# EAGLE design mv-uart (EAGLE 7.6.0)
VERSION: v2
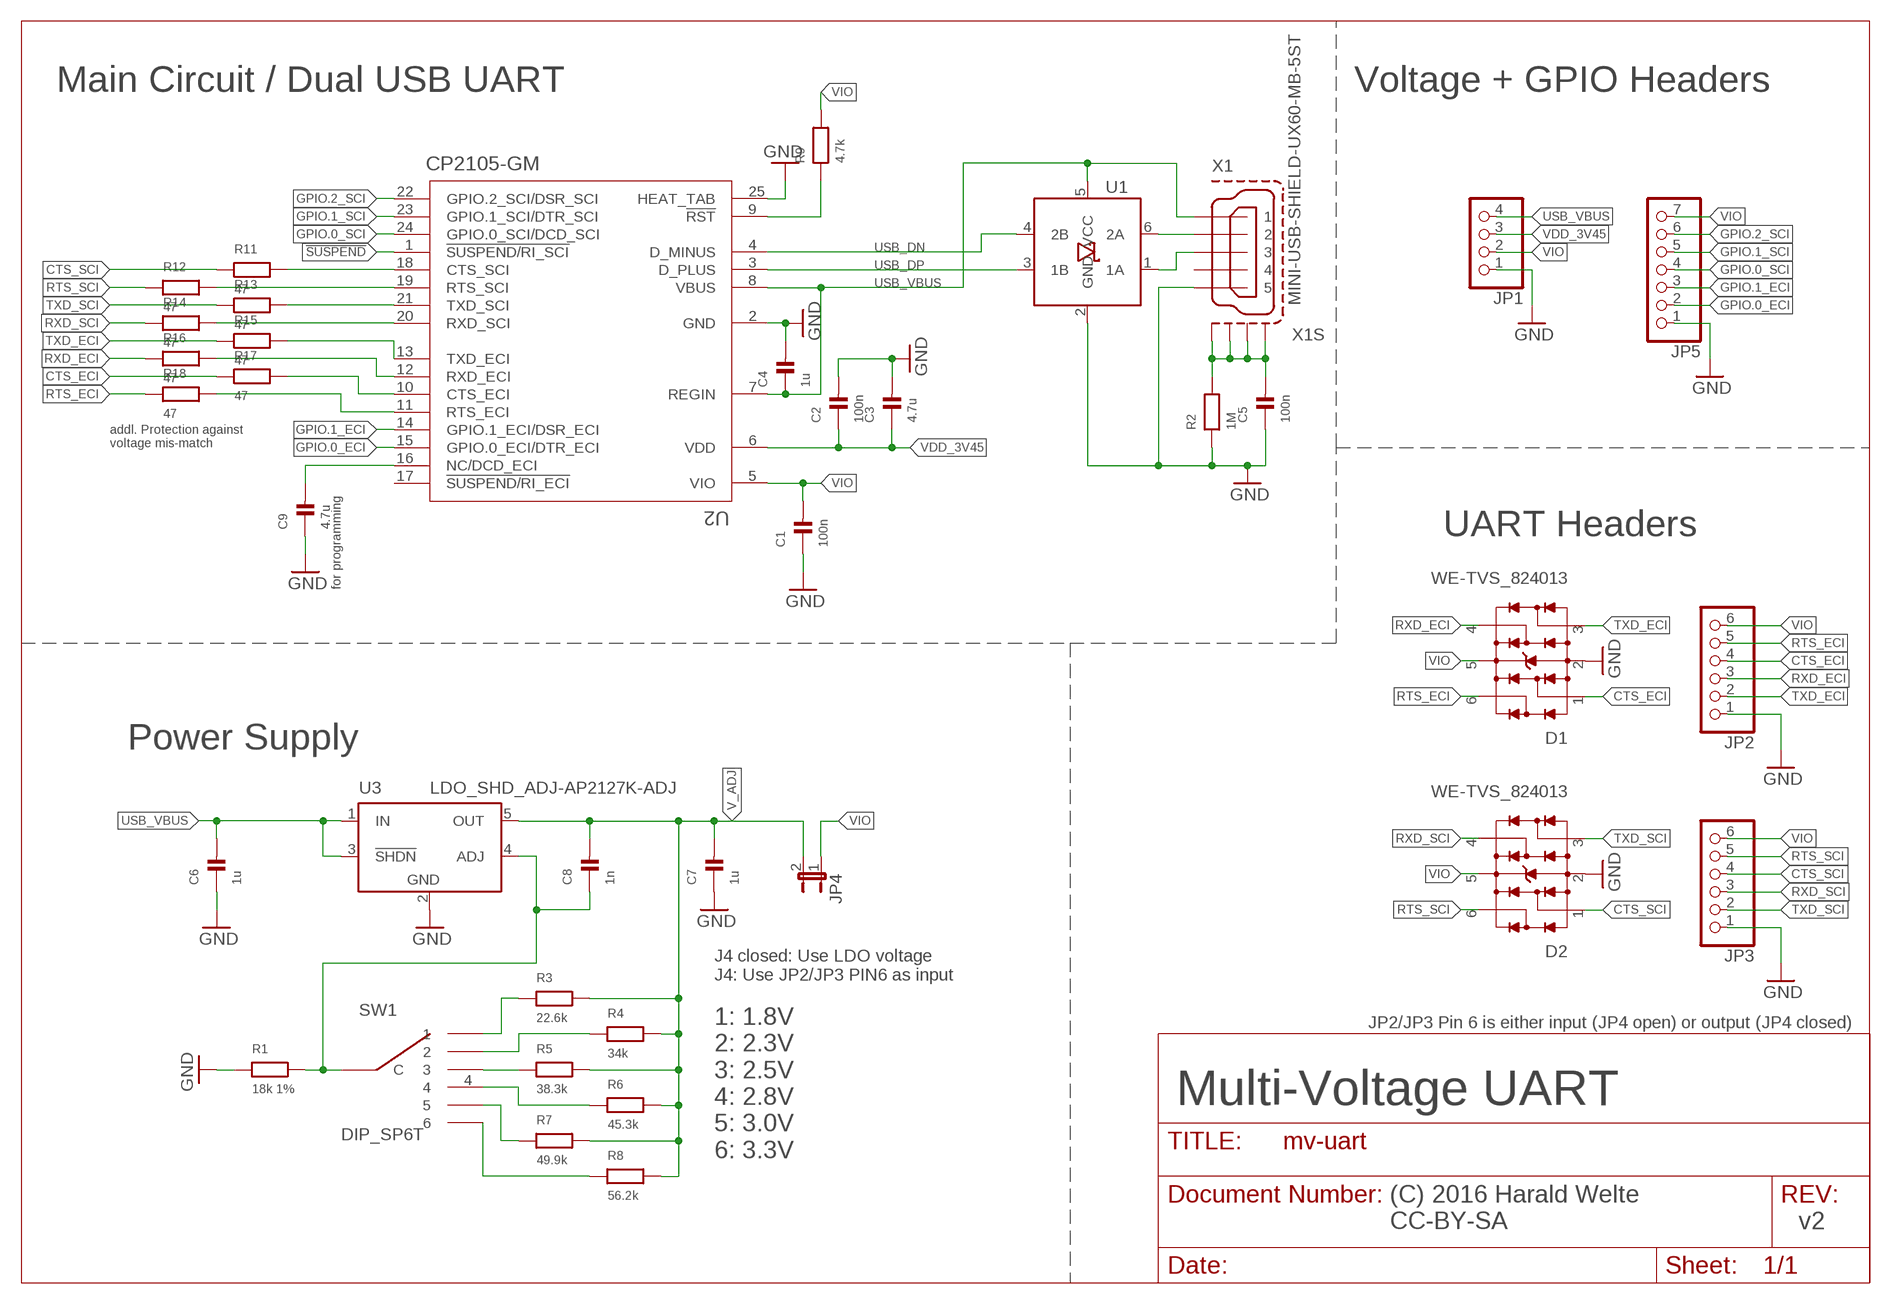
[diagram p0: schematic, sheet 1]

## Parts
C1  100n  CAP_CERAMIC_0603  [_0603]
C2  100n  CAP_CERAMIC_0603  [_0603]
C3  4.7u  CAP_CERAMIC_0603  [_0603]
C4  1u  CAP_CERAMIC_0603  [_0603]
C5  100n  CAP_CERAMIC_0603  [_0603]
C6  1u  CAP_CERAMIC_0603  [_0603]
C7  1u  CAP_CERAMIC_0603  [_0603]
C8  1n  CAP_CERAMIC_0603  [_0603]
C9  4.7u  CAP_CERAMIC_0603  [_0603]
D1  WE-TVS_824013  [WE-TVS_SOT23-6L]
D2  WE-TVS_824013  [WE-TVS_SOT23-6L]
JP1  PINHD-1X4  [1X04]
JP2  PINHD-1X6/90  [1X06/90]
JP3  PINHD-1X6/90  [1X06/90]
JP4  JP1E  [JP1]
JP5  PINHD-1X7  [1X07]
R1  18k 1%  RESISTOR_0603  [_0603]
R2  1M  RESISTOR_0603  [_0603]
R3  22.6k  RESISTOR_0603  [_0603]
R4  34k  RESISTOR_0603  [_0603]
R5  38.3k  RESISTOR_0603  [_0603]
R6  45.3k  RESISTOR_0603  [_0603]
R7  49.9k  RESISTOR_0603  [_0603]
R8  56.2k  RESISTOR_0603  [_0603]
R9  4.7k  RESISTOR_0603  [_0603]
R11  47  RESISTOR_0603  [_0603]
R12  47  RESISTOR_0603  [_0603]
R13  47  RESISTOR_0603  [_0603]
R14  47  RESISTOR_0603  [_0603]
R15  47  RESISTOR_0603  [_0603]
R16  47  RESISTOR_0603  [_0603]
R17  47  RESISTOR_0603  [_0603]
R18  47  RESISTOR_0603  [_0603]
SW1  DIP_SP6T  [DIP_SP6T]
U1  IP4234CZ6  [TSOP-6]
U2  CP2105-GM  [QFN24_4X4]
U3  LDO_SHD_ADJ-AP2127K-ADJ  [SOT23L]
X1  MINI-USB-SHIELD-UX60-MB-5ST  [UX60-MB-5ST]

## Nets
!SUSPEND: U2.1(!SUSPEND/RI_SCI)
_USB_DN: U1.6(2A) X1.2
_USB_DP: U1.1(1A) X1.3
CTS_ECI: D1.1 JP2.4 R17.1
CTS_SCI: D2.1 JP3.4 R11.1
GND: C1.1 C2.2 C3.2 C4.2 C5.1 C6.1 C7.1 C9.1 D1.2(GND) D2.2(GND) JP1.1 JP2.1 JP3.1 JP5.1 R1.1 R2.1 U1.2(GND) U2.2(GND) U2.25(HEAT_TAB) U3.2(GND) X1.5
GPIO.0_ECI: JP5.2 U2.15(GPIO.0_ECI/DTR_ECI)
GPIO.0_SCI: JP5.4 U2.24(GPIO.0_SCI/DCD_SCI)
GPIO.1_ECI: JP5.3 U2.14(GPIO.1_ECI/DSR_ECI)
GPIO.1_SCI: JP5.5 U2.23(GPIO.1_SCI/DTR_SCI)
GPIO.2_SCI: JP5.6 U2.22(GPIO.2_SCI/DSR_SCI)
N$1: R3.1 SW1.1
N$2: R4.1 SW1.2
N$3: R5.1 SW1.3
N$4: R6.1 SW1.4
N$5: C5.2 R2.2 X1.M1(S1) X1.M2(S2) X1.M3(S3) X1.M4(S4)
N$6: R7.1 SW1.5
N$7: R8.1 SW1.6
N$8: R9.1 U2.9(!RST)
N$9: C9.2 U2.16(NC/DCD_ECI)
N$10: R11.2 U2.18(CTS_SCI)
N$11: R12.2 U2.19(RTS_SCI)
N$12: R13.2 U2.21(TXD_SCI)
N$13: R14.2 U2.20(RXD_SCI)
N$14: R15.2 U2.13(TXD_ECI)
N$15: C8.1 R1.2 SW1.C U3.4(ADJ)
N$16: R16.2 U2.12(RXD_ECI)
N$17: R17.2 U2.10(CTS_ECI)
N$18: R18.2 U2.11(RTS_ECI)
RTS_ECI: D1.6 JP2.5 R18.1
RTS_SCI: D2.6 JP3.5 R12.1
RXD_ECI: D1.4 JP2.3 R16.1
RXD_SCI: D2.4 JP3.3 R14.1
TXD_ECI: D1.3 JP2.2 R15.1
TXD_SCI: D2.3 JP3.2 R13.1
USB_DN: U1.4(2B) U2.4(D_MINUS)
USB_DP: U1.3(1B) U2.3(D_PLUS)
USB_VBUS: C4.1 C6.2 JP1.4 U1.5(VCC) U2.7(REGIN) U2.8(VBUS) U3.1(IN) U3.3(!SHDN) X1.1
V_ADJ: C7.2 C8.2 JP4.2 R3.2 R4.2 R5.2 R6.2 R7.2 R8.2 U3.5(OUT)
VDD_3V45: C2.1 C3.1 JP1.3 U2.6(VDD)
VIO: C1.2 D1.5(VDD) D2.5(VDD) JP1.2 JP2.6 JP3.6 JP4.1 JP5.7 R9.2 U2.5(VIO)
Unconnected: U2.17(!SUSPEND/RI_ECI) X1.4

## Notes on the sheet
- Main Circuit / Dual USB UART | Voltage + GPIO Headers
- addl. Protection against
  voltage mis-match
- UART Headers
- for programming
- Power Supply
- J4 closed: Use LDO voltage
  J4: Use JP2/JP3 PIN6 as input
- JP2/JP3 Pin 6 is either input (JP4 open) or output (JP4 closed)
- Multi-Voltage UART
- 1: 1.8V
  2: 2.3V
  3: 2.5V
  4: 2.8V
  5: 3.0V
  6: 3.3V
- (C) 2016 Harald Welte
  CC-BY-SA

## Library data of the parts
C1 C2 C5 = rc-sysmocom:CAP_CERAMIC: Ceramic Capacitors 0402 - 0402 Surface Mount Capacitors 16pF 50V 5% [Digikey: 445-4899-2-ND] 18pF 50V 5% [Digikey: 490-1281-2-ND] 22pF 50V 5% [Digikey: 490-1283-2-ND] 68pF 50V 5% [Digikey: 490-1289-2-ND] 0.1uF 10V 10% [Digikey: 490-1318-2-ND] 1.0uF 6.3V 10% [Digikey: 490-1320-2-ND] 0603 - 0603 Surface Mount Capacitors 16 pF 50V 5% [Digikey: 445-5051-2-ND] 22 pF 50V [Digikey: PCC220ACVTR-ND] 33 pF 50V 5% [Digikey: 490-1415-1-ND] 56pF 50V 5% [Digikey: 490-1421-1-ND] 220pF 50V 5% [Digikey: 445-1285-1-ND] 680 pF 50V 2200 pF 50V 5% C0G [Digikey: 445-1297-1-ND] 5600 pF 100V 5% X7R [Digikey: 478-3711-1-ND] 0.1 µF 25V 10% [Digikey: PCC2277TR-ND] 0.22 µF 16V 10% X7R [Digikey: 445-1318-1-ND] 1.0 µF 25V 10% [Digikey: 445-5146-2-ND] 0603 - RF Specific 3pF 250V +/-0.1pF RF [Digikey: 712-1347-1-ND] 18 pF 250V 5% [Digikey: 478-3505-1-ND or 712-1322-1-ND] 56 pF 250V 5% C0G RF [Digikey: 490-4867-1-ND] 68 pF 250V RF [Digikey: 490-4868-1-ND] 0805 - 0805 Surface Mount Capacitors 220 pF 250V 2% RF Ceramic Capacitor [Digikey: 712-1398-1-ND] 1000 pF 50V 2% NP0 Ceramic Capacitor [Digikey: 478-3760-1-ND] 0.1 µF 25V 10% Ceramic Capacitor [Digikey: PCC1828TR-ND] 1.0 µF 16V 10% Ceramic Capacitor[Digikey: 490-1691-2-ND] 10.0 µF 10V 10% Ceramic Capacitor[Digikey: 709-1228-1-ND] 10.0 uF 16V 10% Ceramic Capacitor [Digikey: 478-5165-2-ND] 47 uF 6.3V 20% Ceramic Capacitor [Digikey: 587-1779-1-ND or 399-5506-1-ND] 1206 - 1206 Surface Mount Capacitors 47uF 10V 20% Ceramic Capacitor [Digikey: 490-5528-1-ND or 399-5508-1-ND or 445-6010-1-ND] 100uF 6.3V -20%, +80% Y5V Ceramic Capacitor (Digikey: 490-4512-1-ND, Mouser: 81-GRM31CF50J107ZE1L) 1810 - 1810 Surface Mount Capacitors High volt MLC; no solder stop between for higher isolation; CLASS: CAPACITOR; DESCRIPTION: 0.10µF 16V Ceramic Capacitor X5R 0201 (0603 Metric) 0.024" L x 0.012" W (0.60mm x 0.30mm); LINK: http://www.digikey.com/product-detail/en/murata-electronics-north-america/GRM033R61C104KE84D/490-9985-1-ND/5026290; MANUFACTURER: Murata Electronics North America; MANUFACTURERPARTNUMBER: GRM033R61C104KE84D; POPULATED: TRUE; ROHSCERTIFICATE: UNKNOWN ROHS CERTIFICATE; SOURCE: DIGIKEY; SOURCEPARTNUMBER: 490-9985-1-ND
C3 C9 = rc-sysmocom:CAP_CERAMIC: Ceramic Capacitors 0402 - 0402 Surface Mount Capacitors 16pF 50V 5% [Digikey: 445-4899-2-ND] 18pF 50V 5% [Digikey: 490-1281-2-ND] 22pF 50V 5% [Digikey: 490-1283-2-ND] 68pF 50V 5% [Digikey: 490-1289-2-ND] 0.1uF 10V 10% [Digikey: 490-1318-2-ND] 1.0uF 6.3V 10% [Digikey: 490-1320-2-ND] 0603 - 0603 Surface Mount Capacitors 16 pF 50V 5% [Digikey: 445-5051-2-ND] 22 pF 50V [Digikey: PCC220ACVTR-ND] 33 pF 50V 5% [Digikey: 490-1415-1-ND] 56pF 50V 5% [Digikey: 490-1421-1-ND] 220pF 50V 5% [Digikey: 445-1285-1-ND] 680 pF 50V 2200 pF 50V 5% C0G [Digikey: 445-1297-1-ND] 5600 pF 100V 5% X7R [Digikey: 478-3711-1-ND] 0.1 µF 25V 10% [Digikey: PCC2277TR-ND] 0.22 µF 16V 10% X7R [Digikey: 445-1318-1-ND] 1.0 µF 25V 10% [Digikey: 445-5146-2-ND] 0603 - RF Specific 3pF 250V +/-0.1pF RF [Digikey: 712-1347-1-ND] 18 pF 250V 5% [Digikey: 478-3505-1-ND or 712-1322-1-ND] 56 pF 250V 5% C0G RF [Digikey: 490-4867-1-ND] 68 pF 250V RF [Digikey: 490-4868-1-ND] 0805 - 0805 Surface Mount Capacitors 220 pF 250V 2% RF Ceramic Capacitor [Digikey: 712-1398-1-ND] 1000 pF 50V 2% NP0 Ceramic Capacitor [Digikey: 478-3760-1-ND] 0.1 µF 25V 10% Ceramic Capacitor [Digikey: PCC1828TR-ND] 1.0 µF 16V 10% Ceramic Capacitor[Digikey: 490-1691-2-ND] 10.0 µF 10V 10% Ceramic Capacitor[Digikey: 709-1228-1-ND] 10.0 uF 16V 10% Ceramic Capacitor [Digikey: 478-5165-2-ND] 47 uF 6.3V 20% Ceramic Capacitor [Digikey: 587-1779-1-ND or 399-5506-1-ND] 1206 - 1206 Surface Mount Capacitors 47uF 10V 20% Ceramic Capacitor [Digikey: 490-5528-1-ND or 399-5508-1-ND or 445-6010-1-ND] 100uF 6.3V -20%, +80% Y5V Ceramic Capacitor (Digikey: 490-4512-1-ND, Mouser: 81-GRM31CF50J107ZE1L) 1810 - 1810 Surface Mount Capacitors High volt MLC; no solder stop between for higher isolation; CLASS: CAPACITOR; DESCRIPTION: 4.7µF 10V Ceramic Capacitor X5R 0603 (1608 Metric) 0.063" L x 0.031" W (1.60mm x 0.80mm); LINK: http://www.digikey.com/product-detail/en/samsung-electro-mechanics-america-inc/CL10A475KP8NNNC/1276-1044-1-ND/3889130; MANUFACTURER: Samsung Electro-Mechanics America, Inc.; MANUFACTURERPARTNUMBER: CL10A475KP8NNNC; POPULATED: TRUE; ROHSCERTIFICATE: UNKNOWN ROHS CERTIFICATE; SOURCE: DIGIKEY; SOURCEPARTNUMBER: 1276-1044-1-ND
C4 C6 C7 = rc-sysmocom:CAP_CERAMIC: Ceramic Capacitors 0402 - 0402 Surface Mount Capacitors 16pF 50V 5% [Digikey: 445-4899-2-ND] 18pF 50V 5% [Digikey: 490-1281-2-ND] 22pF 50V 5% [Digikey: 490-1283-2-ND] 68pF 50V 5% [Digikey: 490-1289-2-ND] 0.1uF 10V 10% [Digikey: 490-1318-2-ND] 1.0uF 6.3V 10% [Digikey: 490-1320-2-ND] 0603 - 0603 Surface Mount Capacitors 16 pF 50V 5% [Digikey: 445-5051-2-ND] 22 pF 50V [Digikey: PCC220ACVTR-ND] 33 pF 50V 5% [Digikey: 490-1415-1-ND] 56pF 50V 5% [Digikey: 490-1421-1-ND] 220pF 50V 5% [Digikey: 445-1285-1-ND] 680 pF 50V 2200 pF 50V 5% C0G [Digikey: 445-1297-1-ND] 5600 pF 100V 5% X7R [Digikey: 478-3711-1-ND] 0.1 µF 25V 10% [Digikey: PCC2277TR-ND] 0.22 µF 16V 10% X7R [Digikey: 445-1318-1-ND] 1.0 µF 25V 10% [Digikey: 445-5146-2-ND] 0603 - RF Specific 3pF 250V +/-0.1pF RF [Digikey: 712-1347-1-ND] 18 pF 250V 5% [Digikey: 478-3505-1-ND or 712-1322-1-ND] 56 pF 250V 5% C0G RF [Digikey: 490-4867-1-ND] 68 pF 250V RF [Digikey: 490-4868-1-ND] 0805 - 0805 Surface Mount Capacitors 220 pF 250V 2% RF Ceramic Capacitor [Digikey: 712-1398-1-ND] 1000 pF 50V 2% NP0 Ceramic Capacitor [Digikey: 478-3760-1-ND] 0.1 µF 25V 10% Ceramic Capacitor [Digikey: PCC1828TR-ND] 1.0 µF 16V 10% Ceramic Capacitor[Digikey: 490-1691-2-ND] 10.0 µF 10V 10% Ceramic Capacitor[Digikey: 709-1228-1-ND] 10.0 uF 16V 10% Ceramic Capacitor [Digikey: 478-5165-2-ND] 47 uF 6.3V 20% Ceramic Capacitor [Digikey: 587-1779-1-ND or 399-5506-1-ND] 1206 - 1206 Surface Mount Capacitors 47uF 10V 20% Ceramic Capacitor [Digikey: 490-5528-1-ND or 399-5508-1-ND or 445-6010-1-ND] 100uF 6.3V -20%, +80% Y5V Ceramic Capacitor (Digikey: 490-4512-1-ND, Mouser: 81-GRM31CF50J107ZE1L) 1810 - 1810 Surface Mount Capacitors High volt MLC; no solder stop between for higher isolation; CLASS: CAPACITOR; DESCRIPTION: 1µF 16V Ceramic Capacitor X5R 0603 (1608 Metric) 0.063" L x 0.031" W (1.60mm x 0.80mm); LINK: http://www.digikey.com/product-detail/en/murata-electronics-north-america/GRM188R61C105KA93J/490-6412-1-ND/3845609; MANUFACTURER: Murata Electronics North America; MANUFACTURERPARTNUMBER: GRM188R61C105KA93J; POPULATED: TRUE; ROHSCERTIFICATE: UNKNOWN ROHS CERTIFICATE; SOURCE: DIGIKEY; SOURCEPARTNUMBER: 490-6412-1-ND
C8 = rc-sysmocom:CAP_CERAMIC: Ceramic Capacitors 0402 - 0402 Surface Mount Capacitors 16pF 50V 5% [Digikey: 445-4899-2-ND] 18pF 50V 5% [Digikey: 490-1281-2-ND] 22pF 50V 5% [Digikey: 490-1283-2-ND] 68pF 50V 5% [Digikey: 490-1289-2-ND] 0.1uF 10V 10% [Digikey: 490-1318-2-ND] 1.0uF 6.3V 10% [Digikey: 490-1320-2-ND] 0603 - 0603 Surface Mount Capacitors 16 pF 50V 5% [Digikey: 445-5051-2-ND] 22 pF 50V [Digikey: PCC220ACVTR-ND] 33 pF 50V 5% [Digikey: 490-1415-1-ND] 56pF 50V 5% [Digikey: 490-1421-1-ND] 220pF 50V 5% [Digikey: 445-1285-1-ND] 680 pF 50V 2200 pF 50V 5% C0G [Digikey: 445-1297-1-ND] 5600 pF 100V 5% X7R [Digikey: 478-3711-1-ND] 0.1 µF 25V 10% [Digikey: PCC2277TR-ND] 0.22 µF 16V 10% X7R [Digikey: 445-1318-1-ND] 1.0 µF 25V 10% [Digikey: 445-5146-2-ND] 0603 - RF Specific 3pF 250V +/-0.1pF RF [Digikey: 712-1347-1-ND] 18 pF 250V 5% [Digikey: 478-3505-1-ND or 712-1322-1-ND] 56 pF 250V 5% C0G RF [Digikey: 490-4867-1-ND] 68 pF 250V RF [Digikey: 490-4868-1-ND] 0805 - 0805 Surface Mount Capacitors 220 pF 250V 2% RF Ceramic Capacitor [Digikey: 712-1398-1-ND] 1000 pF 50V 2% NP0 Ceramic Capacitor [Digikey: 478-3760-1-ND] 0.1 µF 25V 10% Ceramic Capacitor [Digikey: PCC1828TR-ND] 1.0 µF 16V 10% Ceramic Capacitor[Digikey: 490-1691-2-ND] 10.0 µF 10V 10% Ceramic Capacitor[Digikey: 709-1228-1-ND] 10.0 uF 16V 10% Ceramic Capacitor [Digikey: 478-5165-2-ND] 47 uF 6.3V 20% Ceramic Capacitor [Digikey: 587-1779-1-ND or 399-5506-1-ND] 1206 - 1206 Surface Mount Capacitors 47uF 10V 20% Ceramic Capacitor [Digikey: 490-5528-1-ND or 399-5508-1-ND or 445-6010-1-ND] 100uF 6.3V -20%, +80% Y5V Ceramic Capacitor (Digikey: 490-4512-1-ND, Mouser: 81-GRM31CF50J107ZE1L) 1810 - 1810 Surface Mount Capacitors High volt MLC; no solder stop between for higher isolation; CLASS: CAPACITOR; DESCRIPTION: 1000pF 100V Ceramic Capacitor X7R 0603 (1608 Metric) 0.063" L x 0.031" W (1.60mm x 0.80mm); LINK: http://www.digikey.com/product-detail/en/samsung-electro-mechanics-america-inc/CL10B102KC8NNNC/1276-1131-1-ND/3889217; MANUFACTURER: Samsung Electro-Mechanics America, Inc.; MANUFACTURERPARTNUMBER: CL10B102KC8NNNC; POPULATED: TRUE; ROHSCERTIFICATE: UNKNOWN ROHS CERTIFICATE; SOURCE: DIGIKEY; SOURCEPARTNUMBER: 1276-1131-1-ND
D1 D2 = Wuerth_Elektronik_eiSos_V6_20140807:WE-TVS_824013: TVS Diode Array WE-TVS, High Speed Series - Low capazity - No leakage current - Low clamping voltage - high ESD voltage protection -- 3.3 VDC Application <http://katalog.we-online.de/media/images/eisos/VarTVS_highspeed_pf2.jpg.jpg> Details see: http://katalog.we-online.de/en/pbs/WE-TVS_High_Speed? Updated by Dan Xu 2014-07-11 2014 (C) Würth Elektronik; CLASS: DIODE; DESCRIPTION: TVS DIODE 3.3VWM 6VC SOT23; LINK: http://www.digikey.com/product-detail/en/wurth-electronics-inc/824013/732-4466-1-ND/3900561; MANUFACTURER: Wurth Electronics Inc; MANUFACTURERPARTNUMBER: 824013; POPULATED: TRUE; ROHSCERTIFICATE: UNKNOWN ROHS CERTIFICATE; SOURCE: DIGIKEY; SOURCEPARTNUMBER: 732-4466-1-ND
JP1 = pinhead:PINHD-1X4: PIN HEADER; CLASS: CONNECTOR\JUMPER; DESCRIPTION: 4 Positions Header, Unshrouded, Breakaway Connector 0.100" (2.54mm) Through Hole Gold; LINK: http://www.digikey.com/product-detail/en/harwin-inc/M20-9990445/952-2265-ND/3728229; MANUFACTURER: Harwin Inc.; MANUFACTURERPARTNUMBER: M20-9990445; POPULATED: TRUE; ROHSCERTIFICATE: UNKNOWN ROHS CERTIFICATE; SOURCE: DIGIKEY; SOURCEPARTNUMBER: 952-2265-ND
JP2 JP3 = pinhead:PINHD-1X6: PIN HEADER; CLASS: CONNECTOR\JUMPER; DESCRIPTION: 6 Positions Header, Unshrouded, Breakaway Connector 0.100" (2.54mm) Through Hole, Right Angle Gold; LINK: http://www.digikey.com/product-detail/en/harwin-inc/M20-9960645/952-2247-ND/3728211; MANUFACTURER: Harwin Inc.; MANUFACTURERPARTNUMBER: M20-9960645; POPULATED: TRUE; ROHSCERTIFICATE: UNKNOWN ROHS CERTIFICATE; SOURCE: DIGIKEY; SOURCEPARTNUMBER: 952-2247-ND
JP4 = jumper:JP1E: JUMPER; CLASS: CONNECTOR\JUMPER; DESCRIPTION: NO DESCRIPTION; LINK: UNKNOWN LINK; MANUFACTURER: UNKNOWN MANUFACTURER; MANUFACTURERPARTNUMBER: UNKNOWN MANUFACTURER PART NUMBER; POPULATED: TRUE; ROHSCERTIFICATE: UNKNOWN ROHS CERTIFICATE; SOURCE: UNKNOWN SOURCE; SOURCEPARTNUMBER: UNKNOWN SOURCE PART NUMBER
JP5 = pinhead:PINHD-1X7: PIN HEADER; CLASS: CONNECTOR\JUMPER; DESCRIPTION: 7 Positions Header, Unshrouded, Breakaway Connector 0.100" (2.54mm) Through Hole Gold; LINK: http://www.digikey.com/product-detail/en/sullins-connector-solutions/PRPC007SAAN-RC/S1011EC-07-ND/2775247; MANUFACTURER: Sullins Connector Solutions; MANUFACTURERPARTNUMBER: PRPC007SAAN-RC; POPULATED: TRUE; ROHSCERTIFICATE: UNKNOWN ROHS CERTIFICATE; SOURCE: DIGIKEY; SOURCEPARTNUMBER: S1011EC-07-ND
R1 = rc-sysmocom:RESISTOR: Resistors 0402 - 0402 Surface Mount Package 22 Ohm 1% 1/16W [Digikey: 311-22.0LRTR-ND] 33 Ohm 5% 1/16W 1.0K 5% 1/16W 1.5K 5% 1/16W 2.0K 1% 1/16W 10.0K 1% 1/16W [Digikey: 311-10.0KLRTR-ND] 10.0K 5% 1/16W [Digikey: RMCF0402JT10K0TR-ND] 12.1K 1% 1/16W [Digikey: 311-22.0LRTR-ND] 100.0K 5% 1/16W 0603 - 0603 Surface Mount Package 1/10 Watt 0805 - 0805 Surface Mount Package 1/8 Watt 1206 - 1206 Surface Mount Package 2012 - 2010 Surface Mount Package 0.11 Ohm 1/2 Watt 1% Resistor - Digikey: RHM.11UCT-ND; CLASS: RESISTOR; DESCRIPTION: RES SMD 18K OHM 1% 1/10W 0603; LINK: http://www.digikey.com/product-detail/en/yageo/RC0603FR-0718KL/311-18.0KHRCT-ND/729936; MANUFACTURER: Yageo; MANUFACTURERPARTNUMBER: RC0603FR-0718KL; POPULATED: TRUE; ROHSCERTIFICATE: UNKNOWN ROHS CERTIFICATE; SOURCE: DIGIKEY; SOURCEPARTNUMBER: 311-18.0KHRCT-ND
R2 = rc-sysmocom:RESISTOR: Resistors 0402 - 0402 Surface Mount Package 22 Ohm 1% 1/16W [Digikey: 311-22.0LRTR-ND] 33 Ohm 5% 1/16W 1.0K 5% 1/16W 1.5K 5% 1/16W 2.0K 1% 1/16W 10.0K 1% 1/16W [Digikey: 311-10.0KLRTR-ND] 10.0K 5% 1/16W [Digikey: RMCF0402JT10K0TR-ND] 12.1K 1% 1/16W [Digikey: 311-22.0LRTR-ND] 100.0K 5% 1/16W 0603 - 0603 Surface Mount Package 1/10 Watt 0805 - 0805 Surface Mount Package 1/8 Watt 1206 - 1206 Surface Mount Package 2012 - 2010 Surface Mount Package 0.11 Ohm 1/2 Watt 1% Resistor - Digikey: RHM.11UCT-ND; CLASS: RESISTOR; DESCRIPTION: RES SMD 1M OHM 5% 1/20W 0201; LINK: http://www.digikey.com/product-detail/en/samsung-electro-mechanics-america-inc/RC0603J105CS/1276-3856-1-ND/3966828; MANUFACTURER: Samsung Electro-Mechanics America, Inc.; MANUFACTURERPARTNUMBER: RC0603J105CS; POPULATED: TRUE; ROHSCERTIFICATE: UNKNOWN ROHS CERTIFICATE; SOURCE: DIGIKEY; SOURCEPARTNUMBER: 1276-3856-1-ND
R3 = rc-sysmocom:RESISTOR: Resistors 0402 - 0402 Surface Mount Package 22 Ohm 1% 1/16W [Digikey: 311-22.0LRTR-ND] 33 Ohm 5% 1/16W 1.0K 5% 1/16W 1.5K 5% 1/16W 2.0K 1% 1/16W 10.0K 1% 1/16W [Digikey: 311-10.0KLRTR-ND] 10.0K 5% 1/16W [Digikey: RMCF0402JT10K0TR-ND] 12.1K 1% 1/16W [Digikey: 311-22.0LRTR-ND] 100.0K 5% 1/16W 0603 - 0603 Surface Mount Package 1/10 Watt 0805 - 0805 Surface Mount Package 1/8 Watt 1206 - 1206 Surface Mount Package 2012 - 2010 Surface Mount Package 0.11 Ohm 1/2 Watt 1% Resistor - Digikey: RHM.11UCT-ND; CLASS: RESISTOR; DESCRIPTION: RES SMD 22.6K OHM 1% 1/10W 0603; LINK: http://www.digikey.com/product-detail/en/yageo/RC0603FR-0722K6L/311-22.6KHRCT-ND/730007; MANUFACTURER: Yageo; MANUFACTURERPARTNUMBER: RC0603FR-0722K6L; POPULATED: TRUE; ROHSCERTIFICATE: UNKNOWN ROHS CERTIFICATE; SOURCE: DIGIKEY; SOURCEPARTNUMBER: 311-22.6KHRCT-ND
R4 = rc-sysmocom:RESISTOR: Resistors 0402 - 0402 Surface Mount Package 22 Ohm 1% 1/16W [Digikey: 311-22.0LRTR-ND] 33 Ohm 5% 1/16W 1.0K 5% 1/16W 1.5K 5% 1/16W 2.0K 1% 1/16W 10.0K 1% 1/16W [Digikey: 311-10.0KLRTR-ND] 10.0K 5% 1/16W [Digikey: RMCF0402JT10K0TR-ND] 12.1K 1% 1/16W [Digikey: 311-22.0LRTR-ND] 100.0K 5% 1/16W 0603 - 0603 Surface Mount Package 1/10 Watt 0805 - 0805 Surface Mount Package 1/8 Watt 1206 - 1206 Surface Mount Package 2012 - 2010 Surface Mount Package 0.11 Ohm 1/2 Watt 1% Resistor - Digikey: RHM.11UCT-ND; CLASS: RESISTOR; DESCRIPTION: RES SMD 34K OHM 1% 1/10W 0603; LINK: http://www.digikey.com/product-detail/en/yageo/RC0603FR-0734KL/311-34.0KHRCT-ND/730114; MANUFACTURER: Yageo; MANUFACTURERPARTNUMBER: RC0603FR-0734KL; POPULATED: TRUE; ROHSCERTIFICATE: UNKNOWN ROHS CERTIFICATE; SOURCE: DIGIKEY; SOURCEPARTNUMBER: 311-34.0KHRCT-ND
R5 = rc-sysmocom:RESISTOR: Resistors 0402 - 0402 Surface Mount Package 22 Ohm 1% 1/16W [Digikey: 311-22.0LRTR-ND] 33 Ohm 5% 1/16W 1.0K 5% 1/16W 1.5K 5% 1/16W 2.0K 1% 1/16W 10.0K 1% 1/16W [Digikey: 311-10.0KLRTR-ND] 10.0K 5% 1/16W [Digikey: RMCF0402JT10K0TR-ND] 12.1K 1% 1/16W [Digikey: 311-22.0LRTR-ND] 100.0K 5% 1/16W 0603 - 0603 Surface Mount Package 1/10 Watt 0805 - 0805 Surface Mount Package 1/8 Watt 1206 - 1206 Surface Mount Package 2012 - 2010 Surface Mount Package 0.11 Ohm 1/2 Watt 1% Resistor - Digikey: RHM.11UCT-ND; CLASS: RESISTOR; DESCRIPTION: RES SMD 38.3K OHM 1% 1/10W 0603; LINK: http://www.digikey.com/product-detail/en/yageo/RC0603FR-0738K3L/311-38.3KHRCT-ND/730138; MANUFACTURER: Yageo; MANUFACTURERPARTNUMBER: RC0603FR-0738K3L; POPULATED: TRUE; ROHSCERTIFICATE: UNKNOWN ROHS CERTIFICATE; SOURCE: DIGIKEY; SOURCEPARTNUMBER: 311-38.3KHRCT-ND
R6 = rc-sysmocom:RESISTOR: Resistors 0402 - 0402 Surface Mount Package 22 Ohm 1% 1/16W [Digikey: 311-22.0LRTR-ND] 33 Ohm 5% 1/16W 1.0K 5% 1/16W 1.5K 5% 1/16W 2.0K 1% 1/16W 10.0K 1% 1/16W [Digikey: 311-10.0KLRTR-ND] 10.0K 5% 1/16W [Digikey: RMCF0402JT10K0TR-ND] 12.1K 1% 1/16W [Digikey: 311-22.0LRTR-ND] 100.0K 5% 1/16W 0603 - 0603 Surface Mount Package 1/10 Watt 0805 - 0805 Surface Mount Package 1/8 Watt 1206 - 1206 Surface Mount Package 2012 - 2010 Surface Mount Package 0.11 Ohm 1/2 Watt 1% Resistor - Digikey: RHM.11UCT-ND; CLASS: RESISTOR; DESCRIPTION: RES SMD 45.3K OHM 1% 1/10W 0603; LINK: http://www.digikey.com/product-detail/en/yageo/RC0603FR-0745K3L/311-45.3KHRCT-ND/730192; MANUFACTURER: Yageo; MANUFACTURERPARTNUMBER: RC0603FR-0745K3L; POPULATED: TRUE; ROHSCERTIFICATE: UNKNOWN ROHS CERTIFICATE; SOURCE: DIGIKEY; SOURCEPARTNUMBER: 311-45.3KHRCT-ND
R7 = rc-sysmocom:RESISTOR: Resistors 0402 - 0402 Surface Mount Package 22 Ohm 1% 1/16W [Digikey: 311-22.0LRTR-ND] 33 Ohm 5% 1/16W 1.0K 5% 1/16W 1.5K 5% 1/16W 2.0K 1% 1/16W 10.0K 1% 1/16W [Digikey: 311-10.0KLRTR-ND] 10.0K 5% 1/16W [Digikey: RMCF0402JT10K0TR-ND] 12.1K 1% 1/16W [Digikey: 311-22.0LRTR-ND] 100.0K 5% 1/16W 0603 - 0603 Surface Mount Package 1/10 Watt 0805 - 0805 Surface Mount Package 1/8 Watt 1206 - 1206 Surface Mount Package 2012 - 2010 Surface Mount Package 0.11 Ohm 1/2 Watt 1% Resistor - Digikey: RHM.11UCT-ND; CLASS: RESISTOR; DESCRIPTION: RES SMD 49.9K OHM 1% 1/10W 0603; LINK: http://www.digikey.com/product-detail/en/yageo/RC0603FR-0749K9L/311-49.9KHRCT-ND/730212; MANUFACTURER: Yageo; MANUFACTURERPARTNUMBER: RC0603FR-0749K9L; POPULATED: TRUE; ROHSCERTIFICATE: UNKNOWN ROHS CERTIFICATE; SOURCE: DIGIKEY; SOURCEPARTNUMBER: 311-49.9KHRCT-ND
R8 = rc-sysmocom:RESISTOR: Resistors 0402 - 0402 Surface Mount Package 22 Ohm 1% 1/16W [Digikey: 311-22.0LRTR-ND] 33 Ohm 5% 1/16W 1.0K 5% 1/16W 1.5K 5% 1/16W 2.0K 1% 1/16W 10.0K 1% 1/16W [Digikey: 311-10.0KLRTR-ND] 10.0K 5% 1/16W [Digikey: RMCF0402JT10K0TR-ND] 12.1K 1% 1/16W [Digikey: 311-22.0LRTR-ND] 100.0K 5% 1/16W 0603 - 0603 Surface Mount Package 1/10 Watt 0805 - 0805 Surface Mount Package 1/8 Watt 1206 - 1206 Surface Mount Package 2012 - 2010 Surface Mount Package 0.11 Ohm 1/2 Watt 1% Resistor - Digikey: RHM.11UCT-ND; CLASS: RESISTOR; DESCRIPTION: RES SMD 56.2K OHM 1% 1/10W 0603; LINK: http://www.digikey.com/product-detail/en/yageo/RC0603FR-0756K2L/311-56.2KHRCT-ND/730250; MANUFACTURER: Yageo; MANUFACTURERPARTNUMBER: RC0603FR-0756K2L; POPULATED: TRUE; ROHSCERTIFICATE: UNKNOWN ROHS CERTIFICATE; SOURCE: DIGIKEY; SOURCEPARTNUMBER: 311-56.2KHRCT-ND
R9 = rc-sysmocom:RESISTOR: Resistors 0402 - 0402 Surface Mount Package 22 Ohm 1% 1/16W [Digikey: 311-22.0LRTR-ND] 33 Ohm 5% 1/16W 1.0K 5% 1/16W 1.5K 5% 1/16W 2.0K 1% 1/16W 10.0K 1% 1/16W [Digikey: 311-10.0KLRTR-ND] 10.0K 5% 1/16W [Digikey: RMCF0402JT10K0TR-ND] 12.1K 1% 1/16W [Digikey: 311-22.0LRTR-ND] 100.0K 5% 1/16W 0603 - 0603 Surface Mount Package 1/10 Watt 0805 - 0805 Surface Mount Package 1/8 Watt 1206 - 1206 Surface Mount Package 2012 - 2010 Surface Mount Package 0.11 Ohm 1/2 Watt 1% Resistor - Digikey: RHM.11UCT-ND; CLASS: RESISTOR; DESCRIPTION: RES SMD 4.7K OHM 5% 1/10W 0603; LINK: http://www.digikey.com/product-detail/en/yageo/RC0603JR-074K7L/311-4.7KGRCT-ND/729732; MANUFACTURER: Yageo; MANUFACTURERPARTNUMBER: RC0603JR-074K7L; POPULATED: TRUE; ROHSCERTIFICATE: UNKNOWN ROHS CERTIFICATE; SOURCE: DIGIKEY; SOURCEPARTNUMBER: 311-4.7KGRCT-ND
R11-R18 = rc-sysmocom:RESISTOR: Resistors 0402 - 0402 Surface Mount Package 22 Ohm 1% 1/16W [Digikey: 311-22.0LRTR-ND] 33 Ohm 5% 1/16W 1.0K 5% 1/16W 1.5K 5% 1/16W 2.0K 1% 1/16W 10.0K 1% 1/16W [Digikey: 311-10.0KLRTR-ND] 10.0K 5% 1/16W [Digikey: RMCF0402JT10K0TR-ND] 12.1K 1% 1/16W [Digikey: 311-22.0LRTR-ND] 100.0K 5% 1/16W 0603 - 0603 Surface Mount Package 1/10 Watt 0805 - 0805 Surface Mount Package 1/8 Watt 1206 - 1206 Surface Mount Package 2012 - 2010 Surface Mount Package 0.11 Ohm 1/2 Watt 1% Resistor - Digikey: RHM.11UCT-ND; CLASS: RESISTOR; DESCRIPTION: RES SMD 47 OHM 5% 1/10W 0603; LINK: http://www.digikey.com/product-detail/en/yageo/RC0603JR-0747RL/311-47GRCT-ND/729740; MANUFACTURER: Yageo; MANUFACTURERPARTNUMBER: RC0603JR-0747RL; POPULATED: TRUE; ROHSCERTIFICATE: UNKNOWN ROHS CERTIFICATE; SOURCE: DIGIKEY; SOURCEPARTNUMBER: 311-47GRCT-ND
SW1 = laforge:DIP_SP6T: DIP SP6T switch COPAL SS-10-16; CLASS: UNKNOWN CLASS; DESCRIPTION: Dip Switch SP6T 6 Position Through Hole Rotary with Shaft Actuator 100mA 5VDC; LINK: http://www.digikey.com/product-detail/en/copal-electronics-inc/SS-10-16SP-L-AE/563-1082-ND/948393; MANUFACTURER: Copal Electronics Inc.; MANUFACTURERPARTNUMBER: SS-10-16SP-L-AE; POPULATED: TRUE; ROHSCERTIFICATE: UNKNOWN ROHS CERTIFICATE; SOURCE: DIGIKEY; SOURCEPARTNUMBER: 563-1082-ND
U1 = laforge:IP4234CZ6: NXP IP4234CZ6 - Single USB 2.0 ESD protection to IEC 61000-4-2 level 4; CLASS: IC; DESCRIPTION: TVS DIODE 5.5VWM 6TSOP; LINK: http://www.digikey.com/product-detail/en/nxp-semiconductors/IP4234CZ6,125/568-5869-1-ND/2531156; MANUFACTURER: NXP Semiconductors; MANUFACTURERPARTNUMBER: IP4234CZ6,125; OC_DIGIKEY: 568-5869-1-ND; POPULATED: TRUE; ROHSCERTIFICATE: UNKNOWN ROHS CERTIFICATE; SOURCE: DIGIKEY; SOURCEPARTNUMBER: 568-5869-1-ND
U2 = usb-uart:CP2105-GM: SiLabs CB2105 dual USB UART; CLASS: IC; DESCRIPTION: USB Bridge, USB to UART USB 2.0 UART Interface 24-QFN (4x4); LINK: http://www.digikey.com/product-detail/en/silicon-labs/CP2105-F01-GM/336-2009-5-ND/2486179; MANUFACTURER: Silicon Labs; MANUFACTURERPARTNUMBER: CP2105-F01-GM; OC_DIGIKEY: 336-2009-5-ND; POPULATED: TRUE; ROHSCERTIFICATE: UNKNOWN ROHS CERTIFICATE; SOURCE: DIGIKEY; SOURCEPARTNUMBER: 336-2009-5-ND
U3 = ldo:LDO_SHD_ADJ: 1000mA LDO; CLASS: IC; DESCRIPTION: Linear Voltage Regulator IC Positive Adjustable 1 Output 0.8 V ~ 5.5 V 300mA SOT-23-5; LINK: http://www.digikey.com/product-detail/en/diodes-incorporated/AP2127K-ADJTRG1/AP2127K-ADJTRG1DICT-ND/4505277; MANUFACTURER: Diodes Incorporated; MANUFACTURERPARTNUMBER: AP2127K-ADJTRG1; POPULATED: TRUE; ROHSCERTIFICATE: UNKNOWN ROHS CERTIFICATE; SOURCE: DIGIKEY; SOURCEPARTNUMBER: AP2127K-ADJTRG1DICT-ND
X1 = con-hirose:MINI-USB-SHIELD-: MINI USB Connector Source: http://www.hirose.co.jp/cataloge_hp/e24000019.pdf; CLASS: CONNECTOR; DESCRIPTION: USB - mini B USB 2.0 Receptacle Connector 5 Position Surface Mount, Right Angle, Horizontal; LINK: http://www.digikey.com/product-detail/en/hirose-electric-co-ltd/UX60-MB-5ST/H2959CT-ND/597538; MANUFACTURER: Hirose Electric Co Ltd; MANUFACTURERPARTNUMBER: UX60-MB-5ST; OC_FARNELL: unknown; OC_NEWARK: unknown; POPULATED: TRUE; ROHSCERTIFICATE: UNKNOWN ROHS CERTIFICATE; SOURCE: DIGIKEY; SOURCEPARTNUMBER: H2959CT-ND

## Board
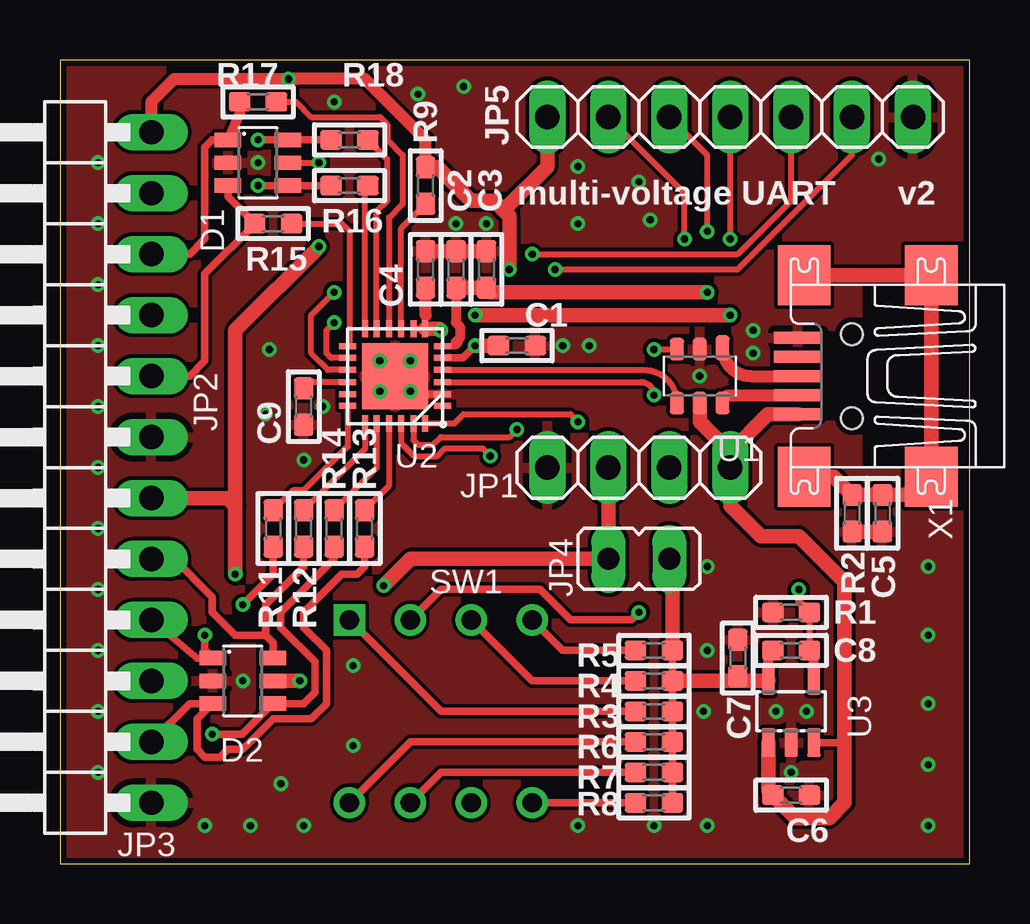
[diagram p1: board, top side]
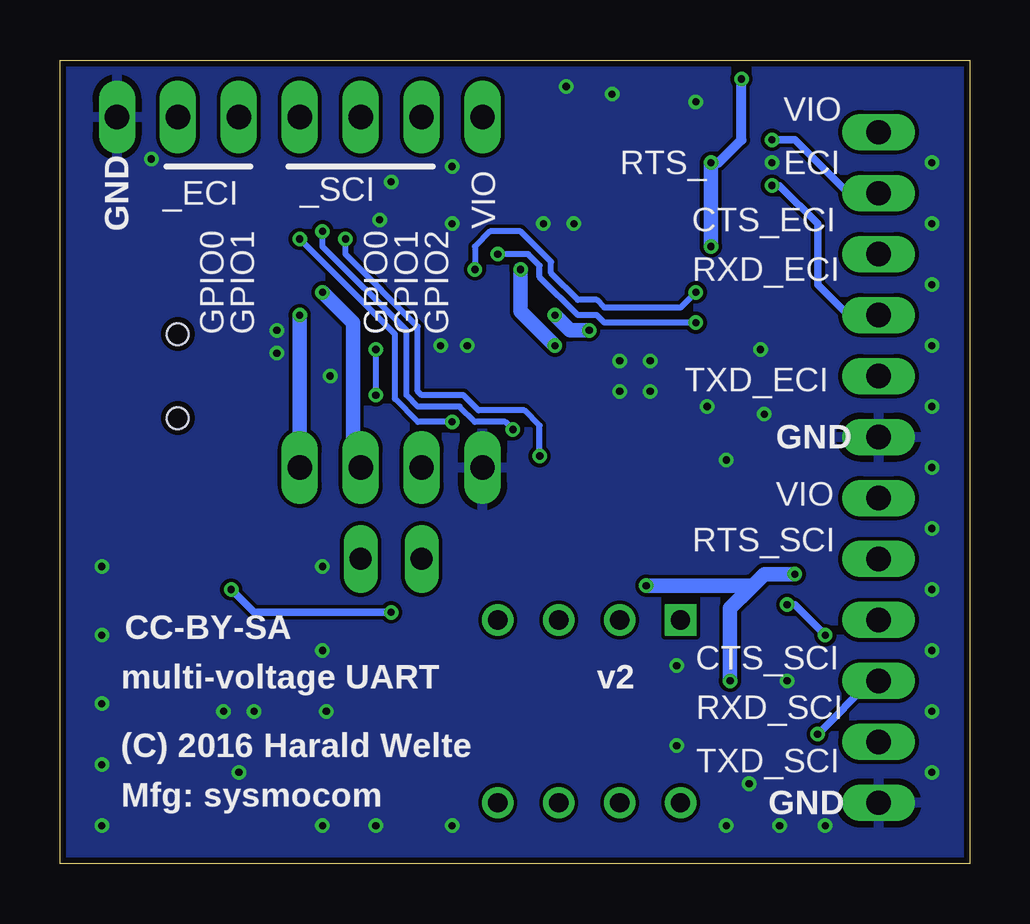
[diagram p2: board, bottom side, seen from below]

Size 37.94 x 33.49 mm. Coordinates in mm from the lower left corner, seen from the top.
Outline: 0,0 37.94,0 37.94,33.49 0,33.49 0,0
Copper layers (1*16): Top 0.035mm / dielectric 1.5mm / Bottom 0.035mm
Design rules "SeeedStudio_2layer_DRU_no_angle_20140221 *": minimum track width 6mil, minimum drill 0.3mm, track to track 6mil, track to pad 6mil, pad to pad 6mil, via to via 6mil, smd to smd 0mil, copper to edge 10mil, drill to drill 10mil, minimum pad ring 10mil, minimum via ring 6mil, stop-mask expansion 2mil, vias tented up to drill 100mil, thermal gap 10mil

### Footprints (pad centres in the part's own frame; a part is rotated, then mirrored left to right if it is on the bottom)
_0603 = smd 0.9 x 0.8: 1 -0.762,0; 2 0.762,0
WE-TVS_SOT23-6L = smd 0.6 x 1.1: 1 -0.95,-1.25; 2 0,-1.25; 3 0.95,-1.25; 4 0.95,1.25; 5 0,1.25; 6 -0.95,1.25
1X04 = drill 1.016 long: 1 -3.81,0; 2 -1.27,0; 3 1.27,0; 4 3.81,0
1X06/90 = drill 1.016 long: 1 -6.35,-3.81; 2 -3.81,-3.81; 3 -1.27,-3.81; 4 1.27,-3.81; 5 3.81,-3.81; 6 6.35,-3.81
JP1 = drill 0.914 long: 1 0,-1.27; 2 0,1.27
1X07 = drill 1.016 long: 1 -7.62,0; 2 -5.08,0; 3 -2.54,0; 4 0,0; 5 2.54,0; 6 5.08,0; 7 7.62,0
DIP_SP6T = drill 0.8 square: 1 -3.81,3.81 | drill 0.8: 2 1.27,3.81; 3 3.81,3.81; 4 -3.81,-3.81; 5 -1.27,-3.81; 6 3.81,-3.81; C -1.27,3.81; C2 1.27,-3.81
TSOP-6 = smd 0.6 x 1.05: 1 -0.95,-1.175 | smd 0.6 x 0.95: 2 0,-1.125; 3 0.95,-1.125; 4 0.95,1.125; 5 0,1.125; 6 -0.95,1.125
QFN24_4X4 = smd 0.7 x 0.25: 1 -1.975,1.245; 2 -1.975,0.762; 3 -1.975,0.254; 4 -1.975,-0.254; 5 -1.975,-0.762; 6 -1.975,-1.245; 13 1.975,-1.245; 14 1.975,-0.762; 15 1.975,-0.254; 16 1.975,0.254; 17 1.975,0.762; 18 1.975,1.245 | smd 0.25 x 0.7: 7 -1.245,-1.975; 8 -0.762,-1.975; 9 -0.254,-1.975; 10 0.254,-1.975; 11 0.762,-1.975; 12 1.245,-1.975; 19 1.245,1.975; 20 0.762,1.975; 21 0.254,1.975; 22 -0.254,1.975; 23 -0.762,1.975; 24 -1.245,1.975 | smd 2.75 x 2.75: 25 0,0
SOT23L = smd 0.55 x 1.2: 1 -0.95,-1.3; 2 0,-1.3; 3 0.95,-1.3; 4 0.95,1.3; 5 -0.95,1.3
UX60-MB-5ST = smd 2 x 0.5: 1 2.25,1.6; 2 2.25,0.8; 3 2.25,0; 4 2.25,-0.8; 5 2.25,-1.6 | smd 2.2 x 2.5: M1 -3.3,-4.2; M2 -3.3,4.2; M3 2,4.2; M4 2,-4.2 | hole 0.9: 0,-1.75; 0,1.75

### Placement (x,y rotation side)
C1  19.05,21.59 180 top
C2  16.51,24.77 90 top
C3  17.78,24.77 90 top
C4  15.24,24.77 90 top
C5  34.29,14.61 90 top
C6  30.48,2.86 180 top
C7  28.26,8.57 270 top
C8  30.48,8.89 180 top
C9  10.16,19.05 90 top
D1  8.26,29.21 270 top
D2  7.62,7.62 270 top
JP1  24.13,16.51 0 top
JP2  0,24.13 90 top
JP3  0,8.89 90 top
JP4  24.13,12.7 270 top
JP5  27.94,31.11 180 top
R1  30.48,10.48 0 top
R2  33.02,14.61 90 top
R3  24.77,6.35 0 top
R4  24.77,7.62 0 top
R5  24.77,8.89 0 top
R6  24.77,5.08 0 top
R7  24.77,3.81 0 top
R8  24.77,2.54 0 top
R9  15.24,28.26 90 top
R11  8.89,13.97 90 top
R12  10.16,13.97 90 top
R13  12.7,13.97 90 top
R14  11.43,13.97 90 top
R15  8.89,26.67 0 top
R16  12.06,28.26 0 top
R17  8.26,31.75 0 top
R18  12.06,30.16 0 top
SW1  15.88,6.35 0 top
U1  26.67,20.32 180 top
U2  13.97,20.32 180 top
U3  30.48,6.35 0 top
X1  33.02,20.32 180 top

### Tracks (layer width: path | path; a pad name or v marks a point on that pad's centre or on a via)
_USB_DN
  Top 0.5: U1.6 arc-90 27.95,19.52 X1.2
_USB_DP
  Top 0.5: U1.1 arc90 28.8,20.32 X1.3
CTS_ECI
  Top 0.307: JP2.4 5.4,25.4 6.03,26.04 6.03,29.84 6.35,30.16 D1.1
  Top 0.406: R17.1 7.49,31.28 D1.1
CTS_SCI  (via drill 0.3)
  Top 0.307: JP3.4 5.72,8.57 D2.1 6.03,8.91 v6.03,9.53 | v7.62,10.79 8.89,12.06 R11.1
  Bottom 0.307: v6.03,9.53 7.3,10.79 v7.62,10.79
GND  (via drill 0.3)
  Top 0.15: U2.25 v14.61,19.68
  Top 0.307: U2.2 14.73,19.56 v14.61,19.68
  Top 0.61: C5.1 R2.1 | C3.2 C2.2 C4.2
  other vias: 7.62,7.62 10.16,1.59 7.94,1.59 6.03,1.59 1.59,3.81 1.59,6.35 1.59,8.89 1.59,11.43 1.59,13.97 1.59,16.51 1.59,19.05 1.59,21.59 1.59,24.13 1.59,26.67 1.59,29.21 8.26,29.21 11.43,31.75 21.59,1.59 24.77,1.59 26.99,1.59 36.2,1.59 36.2,4.13 36.2,6.67 36.2,9.53 36.2,12.38 14.92,32.07 16.83,32.38 34.13,29.37 31.11,6.35 29.84,6.35 30.48,3.81 26.99,12.38 26.99,8.89 20.95,21.59 16.51,26.67 17.78,26.67 26.67,20.32 28.89,21.27 28.89,22.23 10.16,16.83 10.95,19.05 21.59,29.05 24.13,28.42 24.61,26.83 21.59,26.67 8.73,21.43 8.57,18.73 12.22,8.26 12.22,4.92 9.21,3.33 26.83,6.35 22.07,21.59 13.34,19.68 13.34,20.95 14.61,20.95
  pour Top: 0,33.66 38.1,33.66 38.1,0 0,0
  pour Bottom: 0,33.66 38.1,33.66 38.1,0 0,0
GPIO.0_ECI  (via drill 0.3)
  Top 0.254: U2.15 11.18,20.57 10.48,21.27 10.48,22.86 v11.43,23.81 | v20.64,24.77 28.26,24.77 33.02,29.53 JP5.2
  Bottom 0.254: v11.43,23.81 12.06,23.18 15.24,23.18 15.56,23.5 16.35,23.5 17.46,24.61 17.46,25.08 18.73,26.35 20,26.35 20.64,25.72 v20.64,24.77
GPIO.0_SCI  (via drill 0.3)
  Top 0.254: U2.24 16.44,18.34 16.83,18.73 21.27,18.73 v21.59,18.41 | v27.94,26.04 JP5.4
  Bottom 0.254: v21.59,18.41 23.02,18.41 23.97,19.37 23.97,22.07 v27.94,26.04
GPIO.1_ECI  (via drill 0.3)
  Top 0.254: U2.14 11.3,21.08 11.11,21.27 11.11,22.23 v11.43,22.54 | v19.68,25.4 28.26,25.4 30.48,27.62 JP5.3
  Bottom 0.254: v11.43,22.54 15.24,22.54 15.56,22.86 16.35,22.86 17.94,24.45 17.94,24.92 18.41,25.4 v19.68,25.4
GPIO.1_SCI  (via drill 0.3)
  Top 0.254: U2.23 14.73,17.65 14.92,17.46 15.56,17.46 15.88,17.78 18.73,17.78 v19.05,18.1 | v26.99,26.35 26.99,29.53 JP5.5
  Bottom 0.254: v19.05,18.1 19.37,18.41 20.64,18.41 21.27,19.05 23.02,19.05 23.5,19.53 23.5,22.23 26.99,25.72 v26.99,26.35
GPIO.2_SCI  (via drill 0.3)
  Top 0.254: U2.22 14.22,17.53 14.76,16.99 15.72,16.99 16.03,17.3 17.62,17.3 v17.94,16.99 | v26.04,26.04 26.04,27.94 JP5.6
  Bottom 0.254: v17.94,16.99 17.94,18.26 18.57,18.89 20.48,18.89 21.11,19.53 22.86,19.53 23.02,19.68 23.02,22.38 26.04,25.4 v26.04,26.04
N$1
  Top 0.307: SW1.1 15.88,6.35 R3.1
N$2
  Top 0.307: SW1.2 19.68,7.62 R4.1
N$3
  Top 0.307: SW1.3 20.95,8.89 R5.1
N$4
  Top 0.307: SW1.4 14.61,5.08 R6.1
N$5
  Top 0.61: X1.M3 32.27,16.12 R2.2 C5.2 35.57,15.37 X1.M2 X1.M1 X1.M4
N$6
  Top 0.307: SW1.5 15.88,3.81 R7.1
N$7
  Top 0.307: SW1.6 R8.1
N$8
  Top 0.254: U2.9 14.22,26.48 R9.1
N$9
  Top 0.254: U2.16 10.41,20.07 C9.2
N$10
  Top 0.254: U2.18 11.99,17.39 10.16,15.56 9.72,15.56 R11.2
N$11
  Top 0.254: U2.19 12.72,17.3 R12.2
N$12
  Top 0.254: U2.21 13.72,15.75 R13.2
N$13
  Top 0.254: U2.20 13.21,16.51 R14.2
N$14
  Top 0.254: R15.2 11.75,26.67 12.06,26.35 12.06,21.64 U2.13
N$15  (via drill 0.3)
  Top 0.254: R1.2 C8.1
  Top 0.307: SW1.C 15.88,11.43 20,11.43 21.27,10.16 23.81,10.16 v24.13,10.48 | v30.8,11.43 30.8,10.92 R1.2
  Top 0.406: U3.4 31.43,8.7 C8.1
  Bottom 0.307: v24.13,10.48 29.84,10.48 v30.8,11.43
N$16
  Top 0.254: U2.12 12.72,28.16 arc-90 R16.2
N$17
  Top 0.254: R17.2 9.84,31.75 10.48,31.11 13.34,31.11 13.65,30.8 13.65,30.16 14.29,29.53 14.29,27.5 13.72,26.92 U2.10
N$18
  Top 0.254: U2.11 13.21,27.18 13.65,27.62 13.65,29.34 R18.2
RTS_ECI  (via drill 0.3)
  Top 0.307: R18.1 D1.6 v8.26,30.16
  Bottom 0.307: JP2.5 5.08,27.94 7.3,30.16 v8.26,30.16
RTS_SCI
  Top 0.307: JP3.5 4.76,12.7 6.35,11.11 6.35,10.48 7.3,9.53 8.57,9.53 | 8.57,9.53 8.89,9.21 8.89,8.59 D2.6 | 8.57,9.53 8.57,10.79 10.16,12.38 R12.1
RXD_ECI  (via drill 0.3)
  Top 0.307: R16.1 D1.4 v8.26,28.26
  Bottom 0.307: JP2.3 5.08,22.86 6.35,24.13 6.35,26.67 7.94,28.26 v8.26,28.26
RXD_SCI  (via drill 0.3)
  Top 0.307: v6.35,5.4 7.6,5.4 D2.4 10.16,6.67 10.64,7.14 10.64,8.41 9.21,9.84 9.21,10.48 11.43,12.7 R14.1
  Bottom 0.307: JP3.3 4.13,7.62 v6.35,5.4
TXD_ECI
  Top 0.307: D1.3 7,27.79 R15.1 6.03,24.57 6.03,20.95 5.4,20.32 JP2.2
TXD_SCI
  Top 0.307: JP3.2 5.4,6.67 D2.3 6.35,6.67 5.71,6.03 5.71,4.76 6.03,4.45 6.67,4.45 6.99,4.76 7.62,4.76 8.89,6.03 10.48,6.03 11.11,6.67 11.11,8.89 10.16,9.84 10.16,10.51 10.48,10.79 11.75,12.06 12.38,12.06 12.7,12.38 R13.1
USB_DN
  Top 0.254: U2.4 24.34,20.57 arc-90 U1.4
USB_DP  (via drill 0.3)
  Top 0.254: U2.3 24.23,20.07 arc-90 v24.77,19.53 | v24.77,21.43 U1.3
  Bottom 0.254: v24.77,19.53 v24.77,21.43
USB_VBUS  (via drill 0.3)
  Top 0.254: 15.24,22.86 15.21,22.54 U2.7 U2.8
  Top 0.305: U3.3 32.7,5.05 32.7,4.76
  Top 0.5: 15.24,22.86 C4.1
  Top 0.61: X1.1 29.52,18.72 27.94,17.14 | 27.94,17.14 JP1.4 27.94,14.92 29.21,13.65 30.8,13.65 32.7,11.75 32.7,4.76 32.7,2.54 32.07,1.91 30.67,1.91 C6.2 29.53,3.05 U3.1 | U1.5 26.67,18.41 27.94,17.14 | U2.7 15.8,22.3 v15.88,22.23 | v17.3,22.86 v27.94,22.86
  Bottom 0.61: v27.94,22.86 JP1.4 | v15.88,22.23 16.67,22.23 v17.3,22.86
V_ADJ
  Top 0.307: R8.2 R7.2 R6.2 R3.2 R4.2 R5.2
  Top 0.406: C8.2 29.53,8.7 U3.5 28.42,7.65 C7.2
  Top 0.61: JP4.2 25.53,12.57 R5.2 | R4.2 29.5,7.62 U3.5
VDD_3V45  (via drill 0.3)
  Top 0.254: U2.6 16.48,21.57 arc90 16.67,21.91
  Top 0.406: C2.1 16.51,22.54 16.67,22.38 16.67,21.91 16.51,21.75
  Top 0.61: C2.1 C3.1 17.97,23.81 v26.99,23.81
  Bottom 0.61: JP1.3 25.72,16.83 25.72,22.54 v26.99,23.81
VIO  (via drill 0.3)
  Top 0.254: U2.5 16.51,21.08 | D1.5 v10.79,29.21
  Top 0.307: U2.5 16.8,21.08 v17.3,21.59
  Top 0.5: v9.53,32.7 4.76,32.7 3.81,31.75 JP2.6 | v9.53,32.7 9.84,32.7 | R9.2 15.24,30.16 12.7,32.7 v9.53,32.7
  Top 0.61: v10,7.62 D2.5 | R9.2 15.75,29.02 17.14,27.62 18.1,27.62 18.49,27.23 | 18.49,27.23 18.73,26.99 v18.73,24.77 | v17.3,21.59 C1.2 | v7.3,12.06 7.3,14.92 | 7.3,14.92 7.3,22.23 v10.79,25.72 | JP5.7 20.32,29.05 18.49,27.23 | v13.49,11.59 14.61,12.7 JP4.1 JP1.2 | JP3.6 6.99,15.24 7.3,14.92
  Bottom 0.406: v10.79,29.21 10.48,29.21 9.53,30.16 v9.53,32.7
  Bottom 0.61: v7.3,12.06 8.57,12.06 9.13,11.51 | 9.13,11.51 10,10.64 v10,7.62 | v18.73,24.77 18.73,23.02 v17.3,21.59 | v10.79,25.72 v10.79,29.21 | v13.49,11.59 9.21,11.59 9.13,11.51

### Text on the board
tNames: multi-voltage UART
bNames: VIO | ECI | RTS_ | VIO | _SCI | _ECI | CTS_ECI | GND | RXD_ECI | GPIO2 | GPIO1 | GPIO0 | GPIO1 | GPIO0 | TXD_ECI | GND | VIO | RTS_SCI | CC-BY-SA | CTS_SCI | multi-voltage UART | RXD_SCI | TXD_SCI | (C) 2016 Harald Welte | GND | Mfg: sysmocom
Document: GND | VIO | GPIO2_SCI | GPIO1_SCI | GPIO0_SCI | GPIO1_ECI | GPIO0_ECI | VIO | ECI_RTS | ECI_CTS | ECI_TXD | ECI_RXD | GND | VIO | SCI_RTS | SCI_CTS | SCI_TXD | SCI_RXD | GND